# Altium project OpenMVX.PrjPcb
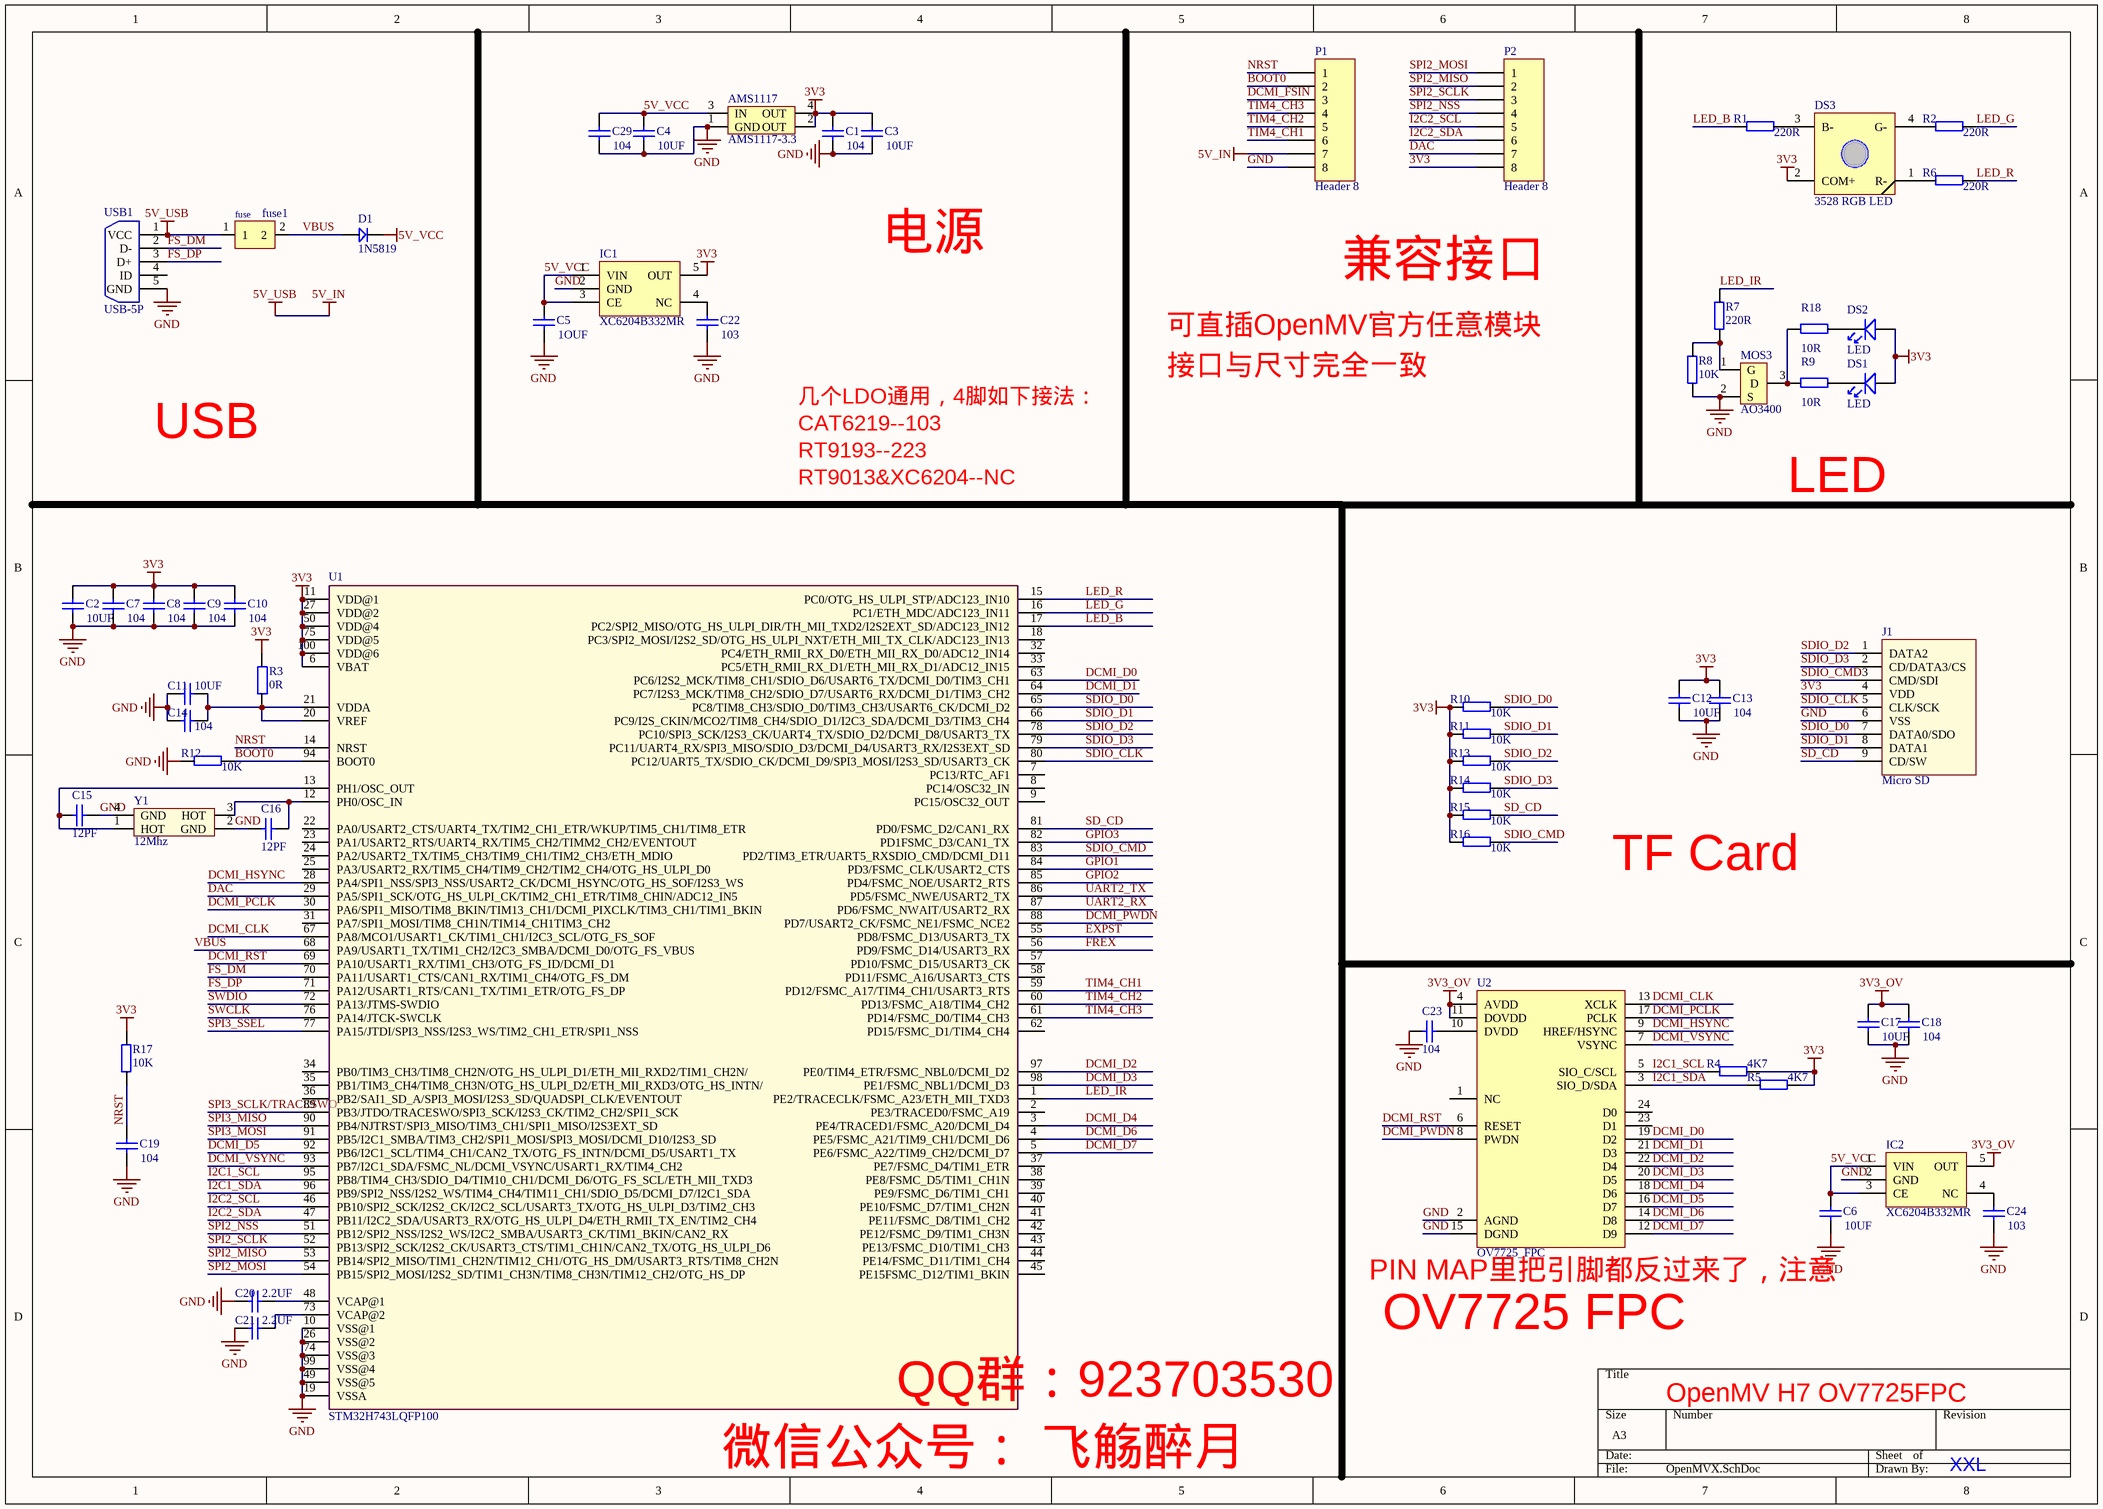
[diagram p0: OpenMVX.SchDoc]
1 sheet, 59 parts. Net scope: global (net labels, ports and power ports of the same name join across sheets).
Board file: OpenMVX.pcbdoc

## Sheet OpenMVX.SchDoc
size A3; PageSetup: Record=PageOptions|CenterHorizontal=True|CenterVertical=True|PrintScale=0.73|XCorrection=1.00|YCorrection=1.00|PrintKind=0|BorderSize=5000000|LeftOffset=0|BottomOffset=0|Orientation=2|PaperLength=1000|PaperWidth=1000|Scale=100|PaperSource=7|PrintQuality=-3|MediaType=1|DitherType=10|PrintScaleMode=1|PaperKind=A4|PaperIndex=9

### Parts
AMS1117  AMS1117-3.3  [AMS1117]
C1  104  [C_0603]
C2  10UF  [C_0603]
C3  10UF  [C_0603]
C4  10UF  [C_0603]
C5  1OUF  [C_0603]
C6  10UF  [C_0603]
C7  104  [C_0603]
C8  104  [C_0603]
C9  104  [C_0603]
C10  104  [C_0603]
C11  10UF  [C_0603]
C12  10UF  [C_0603]
C13  104  [C_0603]
C14  104  [C_0603]
C15  12PF  [C_0603]
C16  12PF  [C_0603]
C17  10UF  [C_0603]
C18  104  [C_0603]
C19  104  [C_0603]
C20  2.2UF  [C_0603]
C21  2.2UF  [C_0603]
C22  103  [C_0603]
C23  104  [C_0603]
C24  103  [C_0603]
C29  104  [C_0603]
D1  1N5819  [SOD-323]
DS1  LED  [LED-1206]
DS2  LED  [LED-1206]
DS3  3528 RGB LED  [3528/1210RGB LED]
fuse1  fuse0603  [0603P]  (value not drawn)
IC1  XC6204B332MR  [SOT23-5L]
IC2  XC6204B332MR  [SOT23-5L]
J1  Micro SD  [Micro SD]
MOS3  AO3400  [SOT-23]
P1  Header 8  [1X08]
P2  Header 8  [1X08]
R1  220R  [0603P]
R2  220R  [0603P]
R3  0R  [0603P]
R4  4K7  [0603P]
R5  4K7  [0603P]
R6  220R  [0603P]
R7  220R  [0603P]
R8  10K  [0603P]
R9  10R  [0603P]
R10  10K  [0603P]
R11  10K  [0603P]
R12  10K  [0603P]
R13  10K  [0603P]
R14  10K  [0603P]
R15  10K  [0603P]
R16  10K  [0603P]
R17  10K  [0603P]
R18  10R  [0603P]
U1  STM32H743LQFP100  [LQFP-100PIN]
U2  OV7725_FPC  [FPC0.5 2H-WS-24P]
USB1  USB-5P  [MICRO_USB]
Y1  12Mhz  [XTAL3225]

### Nets
3V3: AMS1117.2(OUT) AMS1117.4(OUT) C1.2 C2.2 C3.2 C7.2 C8.2 C9.2 C10.2 C12.2 C13.2 DS1.1 DS2.1 DS3.2(COM+) IC1.5(OUT) J1.4(VDD) P2.8 R3.2 R4.1 R5.1 R10.2 R11.2 R13.2 R14.2 R15.2 R16.2 R17.1 U1.6(VBAT) U1.11(VDD@1) U1.27(VDD@2) U1.50(VDD@4) U1.75(VDD@5) U1.100(VDD@6)
3V3_OV: C17.2 C18.2 IC2.5(OUT) U2.4(AVDD) U2.11(DOVDD)
5V_IN: fuse1.1 P1.7 USB1.1(VCC)  [also labelled 5V_USB]
5V_VCC: AMS1117.3(IN) C4.2 C5.2 C6.2 C29.2 D1.2 IC1.1(VIN) IC1.3(CE) IC2.1(VIN) IC2.3(CE)
GND: AMS1117.1(GND) C1.1 C2.1 C3.1 C4.1 C5.1 C6.1 C7.1 C8.1 C9.1 C10.1 C11.2 C12.1 C13.1 C14.2 C15.1 C16.2 C17.1 C18.1 C19.1 C20.2 C21.2 C22.1 C23.2 C24.1 C29.1 IC1.2(GND) IC2.2(GND) J1.6(VSS) MOS3.2(S) P1.8 R8.2 R12.2 U1.10(VSS@1) U1.19(VSSA) U1.26(VSS@2) U1.49(VSS@5) U1.74(VSS@3) U1.99(VSS@4) U2.2(AGND) U2.15(DGND) USB1.5(GND) Y1.2(GND) Y1.4(GND)
BOOT0: P1.2 R12.1 U1.94(BOOT0)
DAC: P2.7 U1.29(PA5/SPI1_SCK/OTG_HS_ULPI_CK/TIM2_CH1_ETR/TIM8_CHIN/ADC12_IN5)
DCMI_CLK: U1.67(PA8/MCO1/USART1_CK/TIM1_CH1/I2C3_SCL/OTG_FS_SOF) U2.13(XCLK)
DCMI_D0: U1.63(PC6/I2S2_MCK/TIM8_CH1/SDIO_D6/USART6_TX/DCMI_D0/TIM3_CH1) U2.19(D2)
DCMI_D1: U1.64(PC7/I2S3_MCK/TIM8_CH2/SDIO_D7/USART6_RX/DCMI_D1/TIM3_CH2) U2.21(D3)
DCMI_D2: U1.97(PE0/TIM4_ETR/FSMC_NBL0/DCMI_D2) U2.22(D4)
DCMI_D3: U1.98(PE1/FSMC_NBL1/DCMI_D3) U2.20(D5)
DCMI_D4: U1.3(PE4/TRACED1/FSMC_A20/DCMI_D4) U2.18(D6)
DCMI_D5: U1.92(PB6/I2C1_SCL/TIM4_CH1/CAN2_TX/OTG_FS_INTN/DCMI_D5/USART1_TX) U2.16(D7)
DCMI_D6: U1.4(PE5/FSMC_A21/TIM9_CH1/DCMI_D6) U2.14(D8)
DCMI_D7: U1.5(PE6/FSMC_A22/TIM9_CH2/DCMI_D7) U2.12(D9)
DCMI_FSIN: P1.3
DCMI_HSYNC: U1.28(PA4/SPI1_NSS/SPI3_NSS/USART2_CK/DCMI_HSYNC/OTG_HS_SOF/I2S3_WS) U2.9(HREF/HSYNC)
DCMI_PCLK: U1.30(PA6/SPI1_MISO/TIM8_BKIN/TIM13_CH1/DCMI_PIXCLK/TIM3_CH1/TIM1_BKIN) U2.17(PCLK)
DCMI_PWDN: U1.88(PD7/USART2_CK/FSMC_NE1/FSMC_NCE2) U2.8(PWDN)
DCMI_RST: U1.69(PA10/USART1_RX/TIM1_CH3/OTG_FS_ID/DCMI_D1) U2.6(RESET)
DCMI_VSYNC: U1.93(PB7/I2C1_SDA/FSMC_NL/DCMI_VSYNC/USART1_RX/TIM4_CH2) U2.7(VSYNC)
EXPST: U1.55(PD8/FSMC_D13/USART3_TX)
FREX: U1.56(PD9/FSMC_D14/USART3_RX)
FS_DM: U1.70(PA11/USART1_CTS/CAN1_RX/TIM1_CH4/OTG_FS_DM) USB1.2(D-)
FS_DP: U1.71(PA12/USART1_RTS/CAN1_TX/TIM1_ETR/OTG_FS_DP) USB1.3(D+)
GPIO1: U1.84(PD3/FSMC_CLK/USART2_CTS)
GPIO2: U1.85(PD4/FSMC_NOE/USART2_RTS)
GPIO3: U1.82(PD1FSMC_D3/CAN1_TX)
I2C1_SCL: R4.2 U1.95(PB8/TIM4_CH3/SDIO_D4/TIM10_CH1/DCMI_D6/OTG_FS_SCL/ETH_MII_TXD3) U2.5(SIO_C/SCL)
I2C1_SDA: R5.2 U1.96(PB9/SPI2_NSS/I2S2_WS/TIM4_CH4/TIM11_CH1/SDIO_D5/DCMI_D7/I2C1_SDA) U2.3(SIO_D/SDA)
I2C2_SCL: P2.5 U1.46(PB10/SPI2_SCK/I2S2_CK/I2C2_SCL/USART3_TX/OTG_HS_ULPI_D3/TIM2_CH3)
I2C2_SDA: P2.6 U1.47(PB11/I2C2_SDA/USART3_RX/OTG_HS_ULPI_D4/ETH_RMII_TX_EN/TIM2_CH4)
LED_B: R1.2 U1.17(PC2/SPI2_MISO/OTG_HS_ULPI_DIR/TH_MII_TXD2/I2S2EXT_SD/ADC123_IN12)
LED_G: R2.1 U1.16(PC1/ETH_MDC/ADC123_IN11)
LED_IR: R7.1 U1.1(PE2/TRACECLK/FSMC_A23/ETH_MII_TXD3)
LED_R: R6.1 U1.15(PC0/OTG_HS_ULPI_STP/ADC123_IN10)
NRST: C19.2 P1.1 R17.2 U1.14(NRST)
SD_CD: J1.9(CD/SW) R15.1 U1.81(PD0/FSMC_D2/CAN1_RX)
SDIO_CLK: J1.5(CLK/SCK) U1.80(PC12/UART5_TX/SDIO_CK/DCMI_D9/SPI3_MOSI/I2S3_SD/USART3_CK)
SDIO_CMD: J1.3(CMD/SDI) R16.1 U1.83(PD2/TIM3_ETR/UART5_RXSDIO_CMD/DCMI_D11)
SDIO_D0: J1.7(DATA0/SDO) R10.1 U1.65(PC8/TIM8_CH3/SDIO_D0/TIM3_CH3/USART6_CK/DCMI_D2)
SDIO_D1: J1.8(DATA1) R11.1 U1.66(PC9/I2S_CKIN/MCO2/TIM8_CH4/SDIO_D1/I2C3_SDA/DCMI_D3/TIM3_CH4)
SDIO_D2: J1.1(DATA2) R13.1 U1.78(PC10/SPI3_SCK/I2S3_CK/UART4_TX/SDIO_D2/DCMI_D8/USART3_TX)
SDIO_D3: J1.2(CD/DATA3/CS) R14.1 U1.79(PC11/UART4_RX/SPI3_MISO/SDIO_D3/DCMI_D4/USART3_RX/I2S3EXT_SD)
SPI2_MISO: P2.2 U1.53(PB14/SPI2_MISO/TIM1_CH2N/TIM12_CH1/OTG_HS_DM/USART3_RTS/TIM8_CH2N)
SPI2_MOSI: P2.1 U1.54(PB15/SPI2_MOSI/I2S2_SD/TIM1_CH3N/TIM8_CH3N/TIM12_CH2/OTG_HS_DP)
SPI2_NSS: P2.4 U1.51(PB12/SPI2_NSS/I2S2_WS/I2C2_SMBA/USART3_CK/TIM1_BKIN/CAN2_RX)
SPI2_SCLK: P2.3 U1.52(PB13/SPI2_SCK/I2S2_CK/USART3_CTS/TIM1_CH1N/CAN2_TX/OTG_HS_ULPI_D6)
SPI3_MISO: U1.90(PB4/NJTRST/SPI3_MISO/TIM3_CH1/SPI1_MISO/I2S3EXT_SD)
SPI3_MOSI: U1.91(PB5/I2C1_SMBA/TIM3_CH2/SPI1_MOSI/SPI3_MOSI/DCMI_D10/I2S3_SD)
SPI3_SCLK/TRACESWO: U1.89(PB3/JTDO/TRACESWO/SPI3_SCK/I2S3_CK/TIM2_CH2/SPI1_SCK)
SPI3_SSEL: U1.77(PA15/JTDI/SPI3_NSS/I2S3_WS/TIM2_CH1_ETR/SPI1_NSS)
SWCLK: U1.76(PA14/JTCK-SWCLK)
SWDIO: U1.72(PA13/JTMS-SWDIO)
TIM4_CH1: P1.6 U1.59(PD12/FSMC_A17/TIM4_CH1/USART3_RTS)
TIM4_CH2: P1.5 U1.60(PD13/FSMC_A18/TIM4_CH2)
TIM4_CH3: P1.4 U1.61(PD14/FSMC_D0/TIM4_CH3)
UART2_RX: U1.87(PD6/FSMC_NWAIT/USART2_RX)
UART2_TX: U1.86(PD5/FSMC_NWE/USART2_TX)
VBUS: D1.1 fuse1.2 U1.68(PA9/USART1_TX/TIM1_CH2/I2C3_SMBA/DCMI_D0/OTG_FS_VBUS)
NetC11_1: C11.1 C14.1 R3.1 U1.20(VREF) U1.21(VDDA)
NetC15_2: C15.2 U1.13(PH1/OSC_OUT) Y1.1(HOT)
NetC16_1: C16.1 U1.12(PH0/OSC_IN) Y1.3(HOT)
NetC20_1: C20.1 U1.48(VCAP@1)
NetC21_1: C21.1 U1.73(VCAP@2)
NetC22_2: C22.2 IC1.4(NC)
NetC23_1: C23.1 U2.10(DVDD)
NetC24_2: C24.2 IC2.4(NC)
NetDS1_2: DS1.2 R9.1
NetDS2_2: DS2.2 R18.1
NetDS3_1: DS3.1(R-) R6.2
NetDS3_3: DS3.3(B-) R1.1
NetDS3_4: DS3.4(G-) R2.2
NetMOS3_1: MOS3.1(G) R7.2 R8.1
NetMOS3_3: MOS3.3(D) R9.2 R18.2

Not connected (* = marked no-connect by the designer): U1 2(PE3/TRACED0/FSMC_A19) 7(PC13/RTC_AF1) 8(PC14/OSC32_IN) 9(PC15/OSC32_OUT) 18(PC3/SPI2_MOSI/I2S2_SD/OTG_HS_ULPI_NXT/ETH_MII_TX_CLK/ADC123_IN13) 22(PA0/USART2_CTS/UART4_TX/TIM2_CH1_ETR/WKUP/TIM5_CH1/TIM8_ETR) 23(PA1/USART2_RTS/UART4_RX/TIM5_CH2/TIMM2_CH2/EVENTOUT) 24(PA2/USART2_TX/TIM5_CH3/TIM9_CH1/TIM2_CH3/ETH_MDIO) 25(PA3/USART2_RX/TIM5_CH4/TIM9_CH2/TIM2_CH4/OTG_HS_ULPI_D0) 31(PA7/SPI1_MOSI/TIM8_CH1N/TIM14_CH1TIM3_CH2) 32(PC4/ETH_RMII_RX_D0/ETH_MII_RX_D0/ADC12_IN14) 33(PC5/ETH_RMII_RX_D1/ETH_MII_RX_D1/ADC12_IN15) 34(PB0/TIM3_CH3/TIM8_CH2N/OTG_HS_ULPI_D1/ETH_MII_RXD2/TIM1_CH2N/) 35(PB1/TIM3_CH4/TIM8_CH3N/OTG_HS_ULPI_D2/ETH_MII_RXD3/OTG_HS_INTN/) 36(PB2/SAI1_SD_A/SPI3_MOSI/I2S3_SD/QUADSPI_CLK/EVENTOUT) 37(PE7/FSMC_D4/TIM1_ETR) 38(PE8/FSMC_D5/TIM1_CH1N) 39(PE9/FSMC_D6/TIM1_CH1) 40(PE10/FSMC_D7/TIM1_CH2N) 41(PE11/FSMC_D8/TIM1_CH2) 42(PE12/FSMC_D9/TIM1_CH3N) 43(PE13/FSMC_D10/TIM1_CH3) 44(PE14/FSMC_D11/TIM1_CH4) 45(PE15FSMC_D12/TIM1_BKIN) 57(PD10/FSMC_D15/USART3_CK) 58(PD11/FSMC_A16/USART3_CTS) 62(PD15/FSMC_D1/TIM4_CH4); U2 1(NC) 23(D1) 24(D0); USB1 4(ID)

### Notes on the sheet
- 电源
- 兼容接口
- 可直插OpenMV官方任意模块
- 接口与尺寸完全一致
- USB
- CAT6219--103
- 几个LDO通用，4脚如下接法：
- RT9193--223
- RT9013&XC6204--NC
- LED
- TF Card
- (near U2) PIN MAP里把引脚都反过来了，注意
- (near U2) OV7725 FPC
- (near U1) QQ群：923703530
- OpenMV H7 OV7725FPC
- (near U1) 微信公众号： 飞觞醉月
- XXL
- (in symbol FUSE) fuse

### Library data of the parts
AMS1117 = AMS1117
C1-C24 C29 = C_0603
D1 = D
DS3 = 3528RGB LED
fuse1 = FUSE
IC1 IC2 = LDO XC6204: LDO; BOM名称: 稳压芯片; 版权归属: 源创客; 学习资源: www.ooocke.com
J1 = Micro SD: Micro SD卡; 版权归属: 源创客; BOM名称: Micro SD卡; 学习资源: www.ooocke.com
MOS3 = MOS-N: AO3400A
P1 P2 = Header 8: Header, 8-Pin; LatestRevisionDate: 17-Jul-2002; LatestRevisionNote: Re-released for DXP Platform.; Publisher: Altium Limited
R1-R18 = R
U2 = OV7725 FPC 24P 0.5MM: pin to pad: 1>24 2>23 3>22 4>21 5>20 6>19 7>18 8>17 9>16 10>15 11>14 12>13 13>12 14>11 15>10 16>9 17>8 18>7 19>6 20>5 21>4 22>3 23>2 24>1
USB1 = USB-5P: 微型USB母座; 版权归属: 源创客; BOM名称: 微型USB母座; 学习资源: www.ooocke.com
Y1 = XTAL_3225: 3225贴片无源晶振